# Altium schematic sheet TPS54331 2A.SchDoc
size A
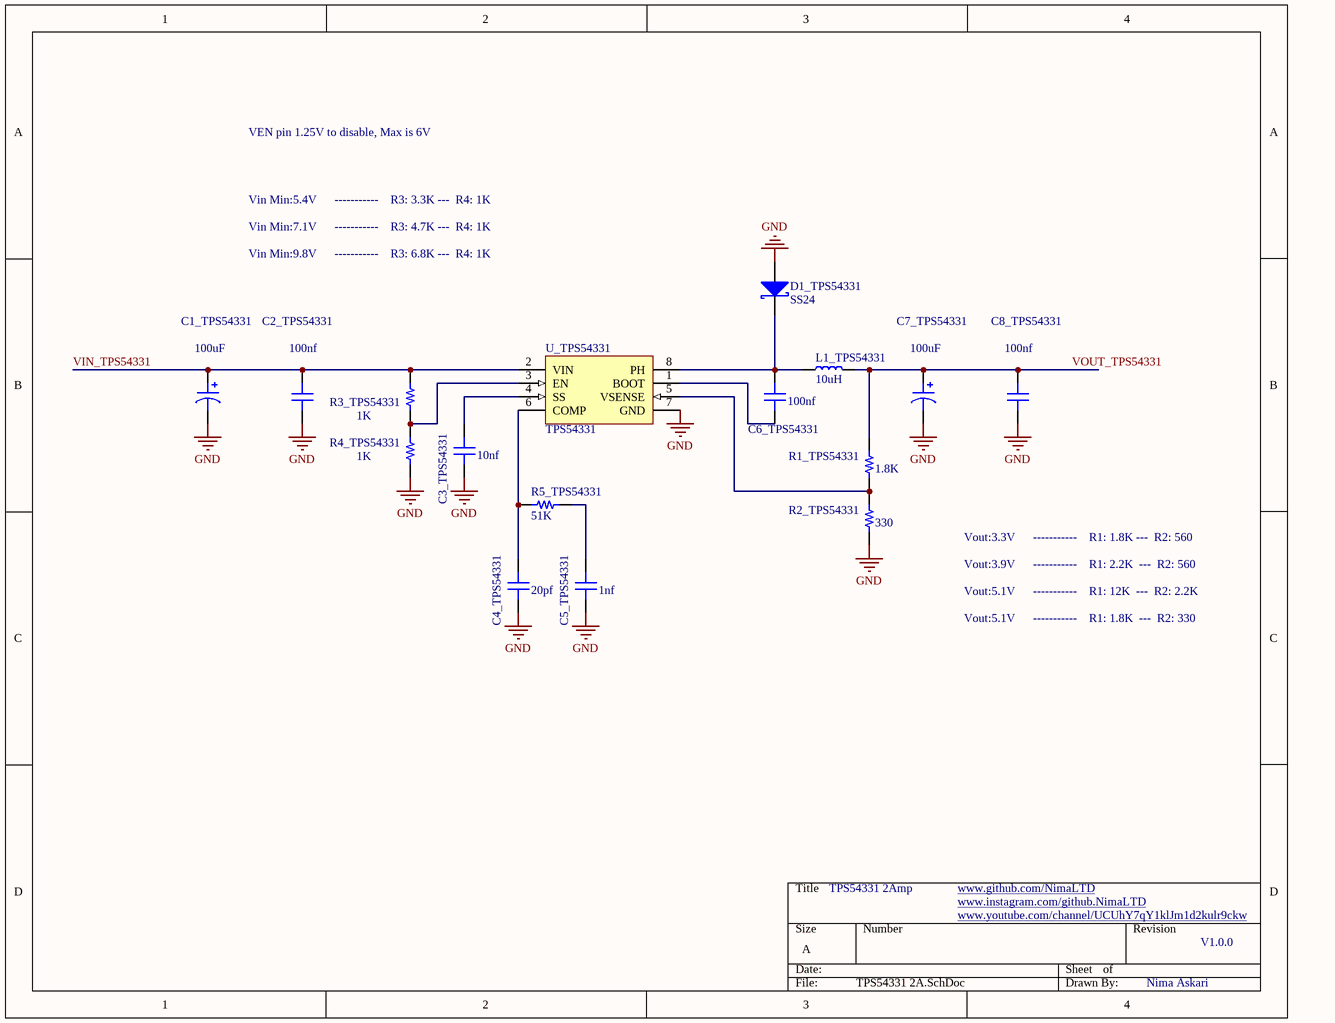
[diagram p0: TPS54331 2A.SchDoc]

## Parts
C1_TPS54331  100uF  [CAP AL SMD D6 H6]
C2_TPS54331  100nf  [CAP 1206]
C3_TPS54331  10nf  [CAP 0805]
C4_TPS54331  20pf  [CAP 0805]
C5_TPS54331  1nf  [CAP 0805]
C6_TPS54331  100nf  [CAP 0805]
C7_TPS54331  100uF  [CAP AL SMD D6 H6]
C8_TPS54331  100nf  [CAP 0805]
D1_TPS54331  Parameter 1: SS24  [DO214AA SMB]  (hidden comment: SS24 SMD)
L1_TPS54331  value 10uH  [IND 10X11]  (hidden comment: Inductor SMD POWER 10X11mm)
R1_TPS54331  1.8K  [RES 0805]
R2_TPS54331  330  [RES 0805]
R3_TPS54331  1K  [RES 0805]
R4_TPS54331  1K  [RES 0805]
R5_TPS54331  51K  [RES 0805]
U_TPS54331  TPS54331  [SOP8]

## Nets
GND: C1_TPS54331.2 C2_TPS54331.1 C3_TPS54331.1 C4_TPS54331.1 C5_TPS54331.1 C7_TPS54331.2 C8_TPS54331.1 D1_TPS54331.1(A) R2_TPS54331.1 R4_TPS54331.1 U_TPS54331.7(GND)
VIN_TPS54331: C1_TPS54331.1 C2_TPS54331.2 R3_TPS54331.2 U_TPS54331.2(VIN)
VOUT_TPS54331: C7_TPS54331.1 C8_TPS54331.2 L1_TPS54331.2 R1_TPS54331.2
NetC3_TPS54331_2: C3_TPS54331.2 U_TPS54331.4(SS)
NetC4_TPS54331_2: C4_TPS54331.2 R5_TPS54331.2 U_TPS54331.6(COMP)
NetC5_TPS54331_2: C5_TPS54331.2 R5_TPS54331.1
NetC6_TPS54331_1: C6_TPS54331.1 U_TPS54331.1(BOOT)
NetC6_TPS54331_2: C6_TPS54331.2 D1_TPS54331.2(K) L1_TPS54331.1 U_TPS54331.8(PH)
NetR1_TPS54331_1: R1_TPS54331.1 R2_TPS54331.2 U_TPS54331.5(VSENSE)
NetR3_TPS54331_1: R3_TPS54331.1 R4_TPS54331.2 U_TPS54331.3(EN)

## Notes on the sheet
- VEN pin 1.25V to disable, Max is 6V
- Vin Min:7.1V      -----------    R3: 4.7K ---  R4: 1K
- Vin Min:5.4V      -----------    R3: 3.3K ---  R4: 1K
- Vin Min:9.8V      -----------    R3: 6.8K ---  R4: 1K
- Vout:3.3V      -----------    R1: 1.8K ---  R2: 560
- Vout:3.9V      -----------    R1: 2.2K  ---  R2: 560
- Vout:5.1V      -----------    R1: 12K  ---  R2: 2.2K
- Vout:5.1V      -----------    R1: 1.8K  ---  R2: 330
- TPS54331 2Amp
- www.github.com/NimaLTD <http://www.github.com/NimaLTD>
- www.instagram.com/github.NimaLTD <http://www.instagram.com/github.NimaLTD>
- www.youtube.com/channel/UCUhY7qY1klJm1d2kulr9ckw <http://www.youtube.com/channel/UCUhY7qY1klJm1d2kulr9ckw>
- V1.0.0
- Nima Askari

## Library data of the parts
C1_TPS54331 C7_TPS54331 = Pol Cap SMD AL D6 H6: SMT Polarised Capacitor; Value: 100uF
C2_TPS54331 = Cap SMD 1206: SMT Capacitor; Value: 100nf
C3_TPS54331 C4_TPS54331 C5_TPS54331 C6_TPS54331 C8_TPS54331 = Cap SMD 0805: SMT Capacitor
  C3_TPS54331: Value: 10nf
  C4_TPS54331: Value: 20pf
  C5_TPS54331: Value: 1nf
  C6_TPS54331 C8_TPS54331: Value: 100nf
D1_TPS54331 = SS24 SMD: 2A Schottky
L1_TPS54331 = Inductor SMD POWER 10X11mm: SMT Inductor
R1_TPS54331 R2_TPS54331 R3_TPS54331 R4_TPS54331 R5_TPS54331 = Res SMD 0805: SMD Resistor
  R1_TPS54331: Value: 1.8K
  R2_TPS54331: Value: 330
  R3_TPS54331 R4_TPS54331: Value: 1K
  R5_TPS54331: Value: 51K
U_TPS54331 = TPS54331: Buck Step Down Regulator with 3.5 to 28 V Input and 0.8 to 25 V Output, -40 to 150 degC, 8-Pin SOIC (D), Green (RoHS & no Sb/Br); ComponentLink1Description: Datasheet; ComponentLink1URL: http://www.ti.com/general/docs/lit/getliterature.tsp?genericPartNumber=TPS54331&fileType=pdf; ComponentLink2Description: Package Specification; ComponentLink2URL: http://www.ti.com/litv/pdf/msoi002j; ComponentLink3Description: URL Link1; ComponentLink3URL: Samples URL:http://www.ti.com/product/tps54331#samples; PartNumber: TPS54331